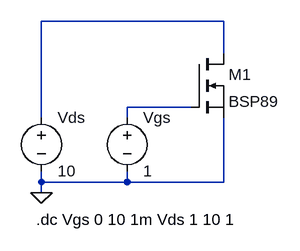
[diagram p0: schematic BSP89.asc]
BSP89.asc, the LTspice schematic file:
Version 4
SHEET 1 880 680
WIRE 224 80 -48 80
WIRE 224 128 224 80
WIRE 176 208 80 208
WIRE -48 224 -48 80
WIRE 80 224 80 208
WIRE -48 320 -48 304
WIRE 80 320 80 304
WIRE 80 320 -48 320
WIRE 224 320 224 224
WIRE 224 320 80 320
WIRE -48 336 -48 320
FLAG -48 336 0
SYMBOL nmos 176 128 R0
SYMATTR InstName M1
SYMATTR Value BSP89
SYMBOL voltage -48 208 R0
WINDOW 123 0 0 Left 0
WINDOW 39 0 0 Left 0
SYMATTR InstName Vds
SYMATTR Value 10
SYMBOL voltage 80 208 R0
WINDOW 123 0 0 Left 0
WINDOW 39 0 0 Left 0
SYMATTR InstName Vgs
SYMATTR Value 1
TEXT -56 376 Left 2 !.dc Vgs 0 10 1m Vds 1 10 1

The netlist it stands for:
* BSP89.asc
M1 N001 N002 0 0 BSP89
Vds N001 0 10
Vgs N002 0 1
.model NMOS NMOS
.model PMOS PMOS
.lib standard.mos
.dc Vgs 0 10 1m Vds 1 10 1
.backanno
.end